# EAGLE schematic explorator_mainboard_v2_58mm (EAGLE 9.6.2)
CNAME: Parrot Teensy Board; CREVISION: 1.0; DESIGNER: Nathan Villicana-Shaw

## Sheet 1 of 2
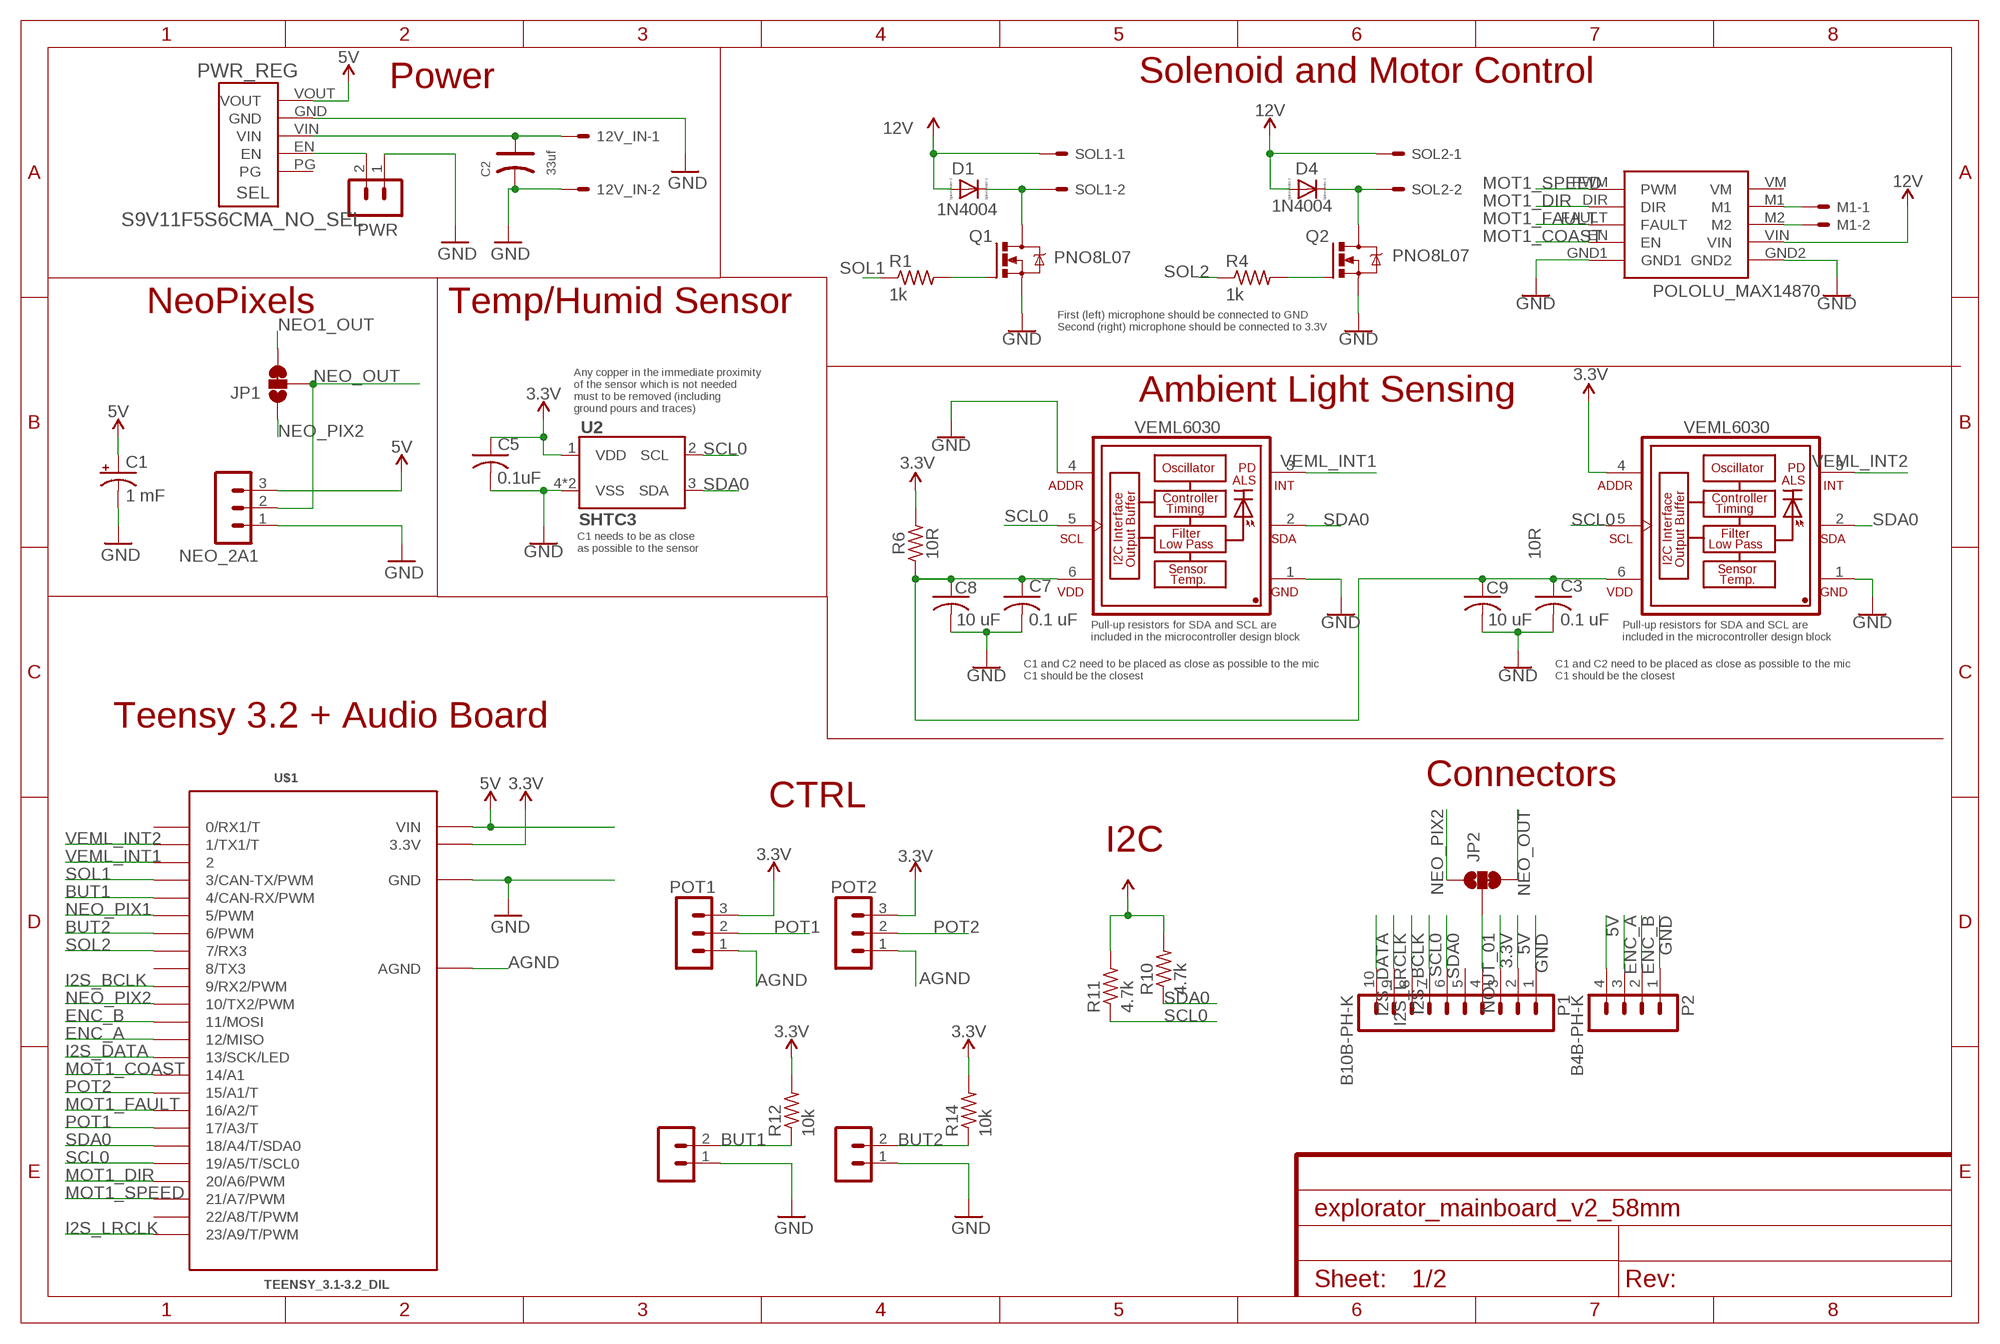
[diagram p0: schematic, sheet 1]

### Parts
12V_IN  5566-2  [5566-2]
BUT1  B2B-PH-K  [B2B-PH-K]
BUT2  B2B-PH-K  [B2B-PH-K]
C1  1 mF  CPOL-USUD-10X10  [UD-10X10_NICHICON]
C2  33uf  DIP-ALUMINUM-47UF-16V(D5-H7MM)  [PC-D5.3MM]
C3  0.1 uF  C-USC0805  [C0805]
C5  0.1uF  C-USC0805  [C0805]
C7  0.1 uF  C-USC0805  [C0805]
C8  10 uF  C-USC0805  [C0805]
C9  10 uF  C-USC0805  [C0805]
D1  1N4004  DIODE_E-DO35-7  [DIODE_DO35-7]
D4  1N4004  DIODE_E-DO35-7  [DIODE_DO35-7]
JP1  JUMPER-SMT_3_1-NC_TRACE_SILK  [SMT-JUMPER_3_1-NC_TRACE_SILK]
JP2  JUMPER-SMT_3_1-NC_TRACE_SILK  [SMT-JUMPER_3_1-NC_TRACE_SILK]
M1  5566-2  [5566-2]
MOT1  POLOLU_MAX14870  [POLOLU_MAX14870]
NEO_2A1  B3B-PH-K  [B3B-PH-K]
P1  B10B-PH-K  [B10B-PH-K]
P2  B4B-PH-K  [B4B-PH-K]
POT1  B3B-PH-K  [B3B-PH-K]
POT2  B3B-PH-K  [B3B-PH-K]
PWR  B2B-PH-K  [B2B-PH-K]
PWR_REG  S9V11F5S6CMA_NO_SEL  [S9V11F3S5CMA_NO_SEL]
Q1  PNO8L07  IRF540  [TO220BV]
Q2  PNO8L07  IRF540  [TO220BV]
R1  1k  R-US_R0805  [R0805]
R4  1k  R-US_R0805  [R0805]
R6  10 R  R-US_R0805  [R0805]
R10  4.7k  R-US_R0805  [R0805]
R11  4.7k  R-US_R0805  [R0805]
R12  10k  R-US_R0805  [R0805]
R14  10k  R-US_R0805  [R0805]
SOL1  5566-2  [5566-2]
SOL2  5566-2  [5566-2]
U2  SHTC3  [SHTC3]
U$1  TEENSY_3.1-3.2_DIL  [TEENSY_3.0-3.2&LC_DIL]
VMEL1  VEML6030  VEML6030-GS15  [VISHAY_VEML6030_2X2X0.87]
VMEL2  VEML6030  VEML6030-GS15  [VISHAY_VEML6030_2X2X0.87]

### Nets
3.3V [3.3V]: C5.1 P1.3 POT1.3 POT2.3 R6.2 R10.2 R11.2 R12.2 R14.2 U2.1(VDD) U$1.3.3V VMEL2.4(ADDR)
5V: C1.+ NEO_2A1.3 P1.2 P2.4 PWR_REG.VOUT U$1.VIN ; also sheet 2
12V [12V_IN]: 12V_IN.1 C2.+ D1.A(C) D4.A(C) MOT1.VIN PWR_REG.VIN SOL1.1 SOL2.1
AGND: POT1.1 POT2.1 U$1.AGND
BUT1: BUT1.2 R12.1 U$1.4(4/CAN-RX/PWM)
BUT2: BUT2.2 R14.1 U$1.6(6/PWM)
ENC_A: P2.3 U$1.12(12/MISO)
ENC_B: P2.2 U$1.11(11/MOSI)
GND: 12V_IN.2 BUT1.1 BUT2.1 C1.- C2.- C3.2 C5.2 C7.2 C8.2 C9.2 MOT1.GND1 MOT1.GND2 NEO_2A1.1 P1.1 P2.1 PWR.1 PWR_REG.GND Q1.S Q2.S U2.4(VSS) U2.5(VSS) U$1.GND VMEL1.1(GND) VMEL1.4(ADDR) VMEL2.1(GND) ; also sheet 2
I2S_BCLK: P1.8 U$1.9(9/RX2/PWM)
I2S_DATA: P1.10 U$1.13(13/SCK/LED)
I2S_LRCLK: P1.9 U$1.23/A9(23/A9/T/PWM)
MOT1_COAST: MOT1.EN U$1.14/A0(14/A1)
MOT1_DIR: MOT1.DIR U$1.20/A6(20/A6/PWM)
MOT1_FAULT: MOT1.FAULT U$1.16/A2(16/A2/T)
MOT1_SPEED: MOT1.PWM U$1.21/A7(21/A7/PWM)
N$1: M1.2 MOT1.M2
N$2: M1.1 MOT1.M1
N$7: C3.1 C7.1 C8.1 C9.1 R6.1 VMEL1.6(VDD) VMEL2.6(VDD)
N$10: PWR.2 PWR_REG.EN
N$13: Q2.G R4.2
N$14: D4.C(A) Q2.D SOL2.2
N$24: Q1.G R1.2
N$25: D1.C(A) Q1.D SOL1.2
NEO1_OUT: JP1.3 ; also sheet 2
NEO_OUT: JP1.2 JP2.3 NEO_2A1.2
NEO_PIX1: U$1.5(5/PWM) ; also sheet 2
NEO_PIX2: JP1.1 JP2.1 U$1.10(10/TX2/PWM)
NOUT_01: JP2.2 P1.4
POT1: POT1.2 U$1.17/A3(17/A3/T)
POT2: POT2.2 U$1.15/A1(15/A1/T)
SCL0: P1.7 R11.1 U2.2(SCL) U$1.19/A5(19/A5/T/SCL0) VMEL1.5(SCL) VMEL2.5(SCL)
SDA0: P1.6 R10.1 U2.3(SDA) U$1.18/A4(18/A4/T/SDA0) VMEL1.2(SDA) VMEL2.2(SDA)
SOL1: R1.1 U$1.3(3/CAN-TX/PWM)
SOL2: R4.1 U$1.7(7/RX3)
VEML_INT1: U$1.2 VMEL1.3(INT)
VEML_INT2: U$1.1(1/TX1/T) VMEL2.3(INT)
Unconnected: MOT1.VM P1.5 PWR_REG.PG U$1.0(0/RX1/T) U$1.8(8/TX3) U$1.22/A8(22/A8/T/PWM)

### Notes on the sheet
- Power | Solenoid and Motor Control
- NeoPixels | Temp/Humid Sensor
- First (left) microphone should be connected to GND
  Second (right) microphone should be connected to 3.3V
- Ambient Light Sensing
- Any copper in the immediate proximity 
  of the sensor which is not needed
  must to be removed (including 
  ground pours and traces)
- C1 needs to be as close
  as possible to the sensor
- 10R | 10R
- Pull-up resistors for SDA and SCL are 
  included in the microcontroller design block
- Pull-up resistors for SDA and SCL are 
  included in the microcontroller design block
- C1 and C2 need to be placed as close as possible to the mic
  C1 should be the closest
- C1 and C2 need to be placed as close as possible to the mic
  C1 should be the closest
- Teensy 3.2 + Audio Board
- Connectors
- CTRL
- I2C

## Sheet 2 of 2
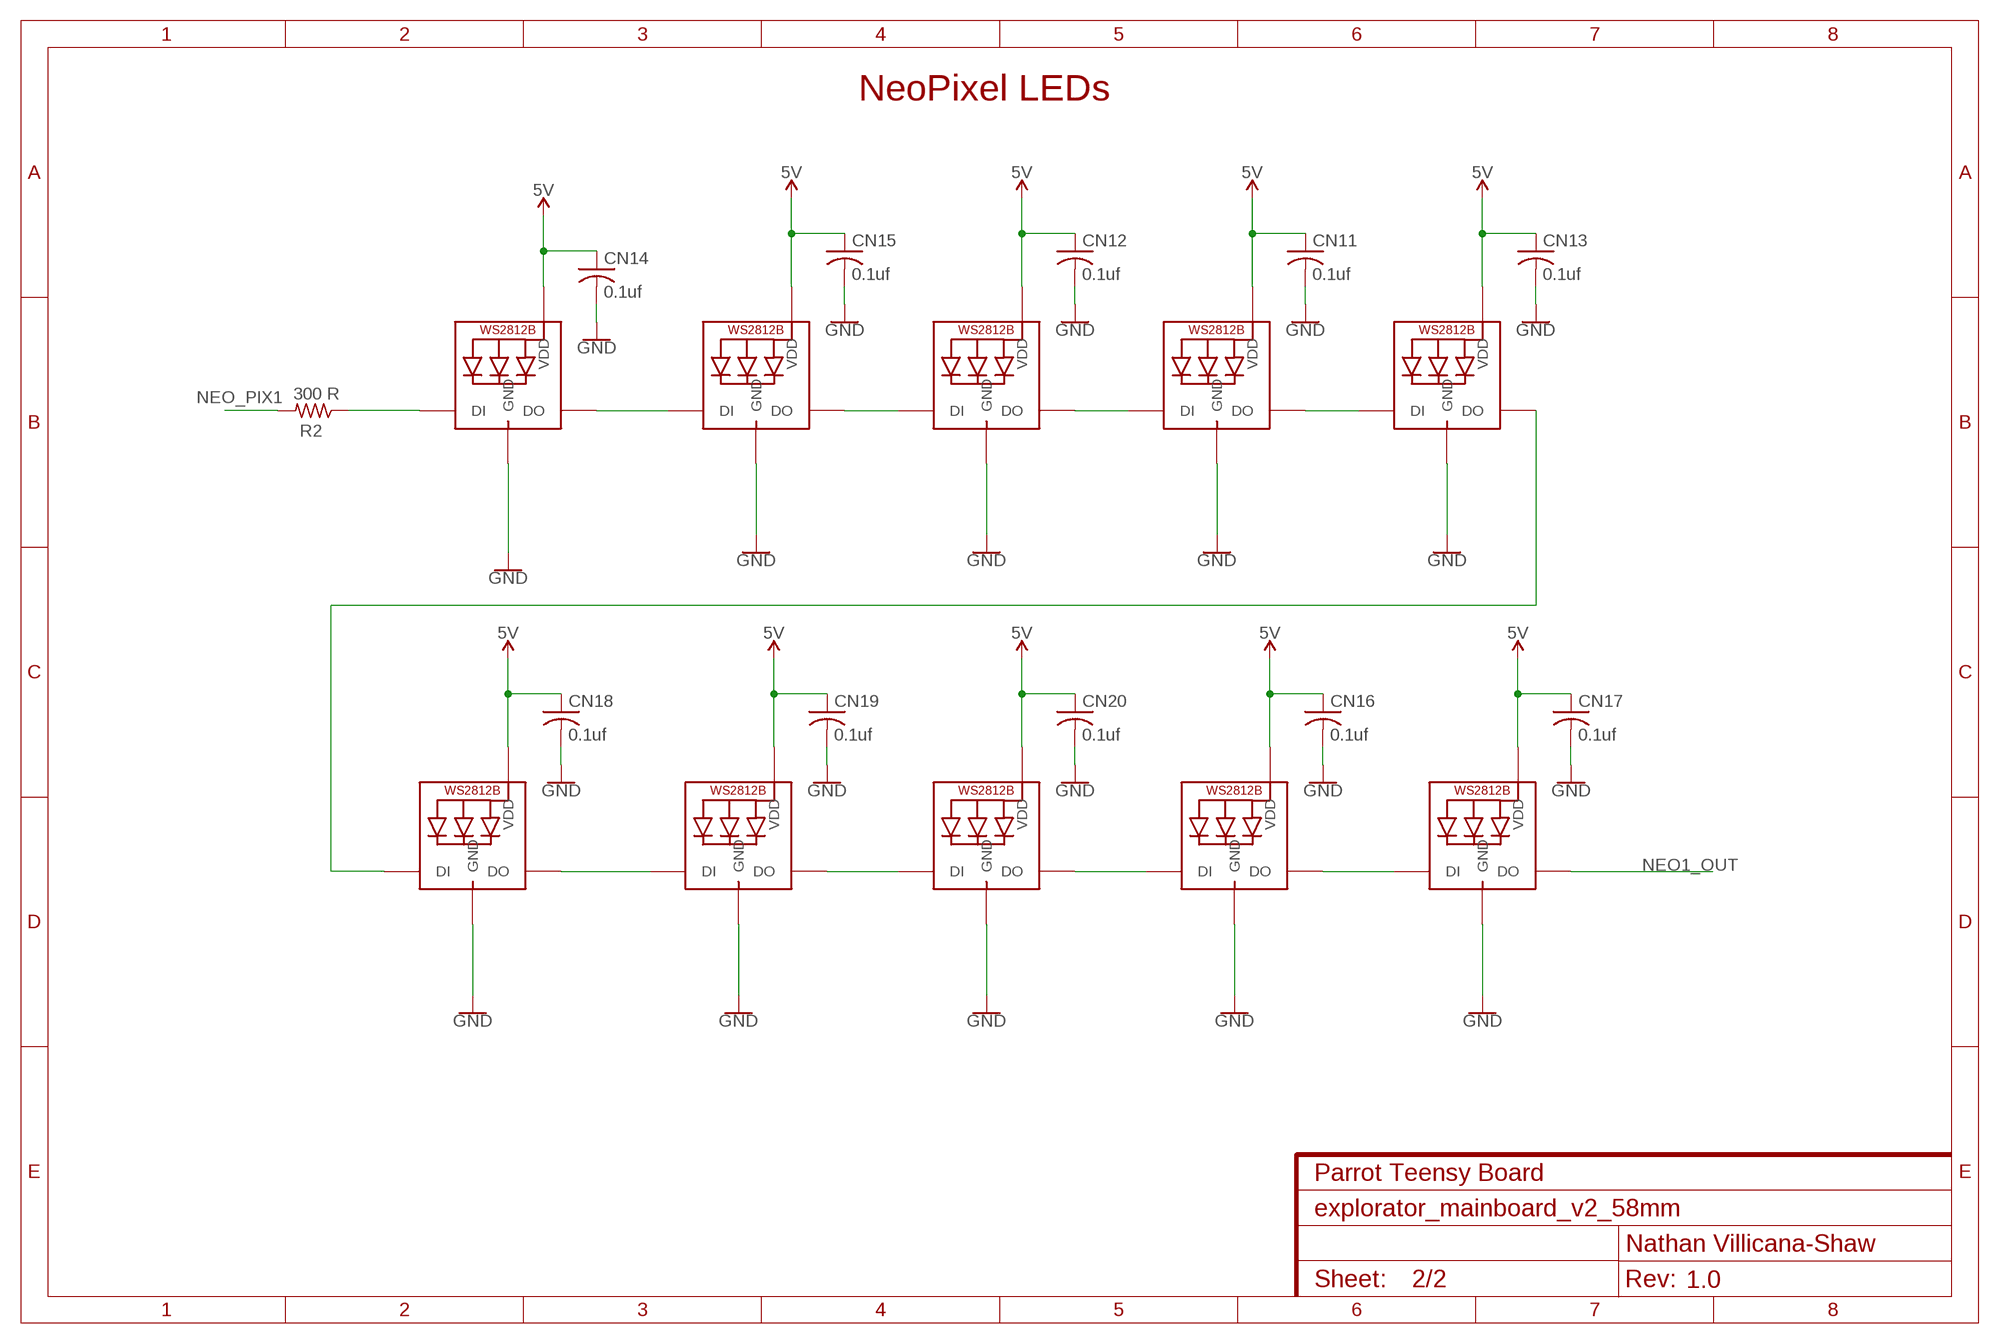
[diagram p1: schematic, sheet 2]

### Parts
CN11  0.1uf  C-USC0805K  [C0805K]
CN12  0.1uf  C-USC0805K  [C0805K]
CN13  0.1uf  C-USC0805K  [C0805K]
CN14  0.1uf  C-USC0805K  [C0805K]
CN15  0.1uf  C-USC0805K  [C0805K]
CN16  0.1uf  C-USC0805K  [C0805K]
CN17  0.1uf  C-USC0805K  [C0805K]
CN18  0.1uf  C-USC0805K  [C0805K]
CN19  0.1uf  C-USC0805K  [C0805K]
CN20  0.1uf  C-USC0805K  [C0805K]
NEO11  WS2812B5050  [WS2812B]
NEO12  WS2812B5050  [WS2812B]
NEO13  WS2812B5050  [WS2812B]
NEO14  WS2812B5050  [WS2812B]
NEO15  WS2812B5050  [WS2812B]
NEO16  WS2812B5050  [WS2812B]
NEO17  WS2812B5050  [WS2812B]
NEO18  WS2812B5050  [WS2812B]
NEO19  WS2812B5050  [WS2812B]
NEO20  WS2812B5050  [WS2812B]
R2  300 R  R-US_R0805  [R0805]

### Nets
5V: CN11.1 CN12.1 CN13.1 CN14.1 CN15.1 CN16.1 CN17.1 CN18.1 CN19.1 CN20.1 NEO11.1-VDD(VDD) NEO12.1-VDD(VDD) NEO13.1-VDD(VDD) NEO14.1-VDD(VDD) NEO15.1-VDD(VDD) NEO16.1-VDD(VDD) NEO17.1-VDD(VDD) NEO18.1-VDD(VDD) NEO19.1-VDD(VDD) NEO20.1-VDD(VDD) ; also sheet 1
GND: CN11.2 CN12.2 CN13.2 CN14.2 CN15.2 CN16.2 CN17.2 CN18.2 CN19.2 CN20.2 NEO11.3-GND(GND) NEO12.3-GND(GND) NEO13.3-GND(GND) NEO14.3-GND(GND) NEO15.3-GND(GND) NEO16.3-GND(GND) NEO17.3-GND(GND) NEO18.3-GND(GND) NEO19.3-GND(GND) NEO20.3-GND(GND) ; also sheet 1
N$17: NEO14.2-DOUT(DO) NEO15.4-DIN(DI)
N$18: NEO12.4-DIN(DI) NEO15.2-DOUT(DO)
N$19: NEO11.4-DIN(DI) NEO12.2-DOUT(DO)
N$20: NEO11.2-DOUT(DO) NEO13.4-DIN(DI)
N$21: NEO13.2-DOUT(DO) NEO18.4-DIN(DI)
N$22: NEO14.4-DIN(DI) R2.1
N$23: NEO18.2-DOUT(DO) NEO19.4-DIN(DI)
N$26: NEO19.2-DOUT(DO) NEO20.4-DIN(DI)
N$27: NEO16.4-DIN(DI) NEO20.2-DOUT(DO)
N$28: NEO16.2-DOUT(DO) NEO17.4-DIN(DI)
NEO1_OUT: NEO17.2-DOUT(DO) ; also sheet 1
NEO_PIX1: R2.2 ; also sheet 1

### Notes on the sheet
- NeoPixel LEDs

## Library data of the parts
12V_IN M1 SOL1 SOL2 = con-molex:5566-2: Mini FIT connector 2 pol Source: http://www.molex.com; MF: MOLEX; OC_FARNELL: 1822072; OC_NEWARK: unknown
BUT1 BUT2 PWR = con-jst-ph:B2B-PH-K: HEADER
C1 = rcl:CPOL-US: POLARIZED CAPACITOR, American symbol; SPICEPREFIX: C
C2 = Seeed-Capacitor:DIP-ALUMINUM-47UF-16V(D5-H7MM): 302030033; MPN: KS 100uF/16V; VALUE: 100uf
C3 C5 C7-C9 = rcl:C-US: CAPACITOR, American symbol; SPICEPREFIX: C
CN11-CN20 = resistor:C-US: CAPACITOR, American symbol
D1 D4 = eagle-ltspice:DIODE_E-: Schottky Diode; SPICEMODEL: diode; SPICEPREFIX: D
JP1 JP2 = SparkFun-Jumpers:JUMPER-SMT_3_1-NC_TRACE: Normally closed trace jumper (1 of 2 connections) This jumper has a trace between two pads so it's normally closed (NC). The other connection is normally open (NO). Use a razor knife to open the connection. For best results follow the IPC guidelines for cutting traces: Cutout at least 0.063 mm (0.005 in). Remove all loose material to clean up the cut area. Seal the cut with an approved epoxy. Reapply solder to reclose the connection, or to close the NO connection.
MOT1 = nathans-custom-parts:POLOLU_MAX14870
NEO11-NEO20 = nathans-custom-parts:WS2812B
NEO_2A1 POT1 POT2 = con-jst-ph:B3B-PH-K: HEADER
P1 = con-jst-ph:B10B-PH-K: HEADER
P2 = con-jst-ph:B4B-PH-K: HEADER
PWR_REG = nathans-custom-parts:S9V11F5S6CMA_NO_SEL
Q1 Q2 = nathans-custom-parts:IRF540: HEXFET Power MOSFET
R1 R4 R10-R12 R14 = rcl:R-US_: RESISTOR, American symbol; SPICEPREFIX: R
R2 R6 = audio amplifier example:R-US_: RESISTOR, American symbol
U2 = SHTC3:SHTC3
U$1 = Teensy_3_and_LC_Series_Boards_v1.4:TEENSY_3.1-3.2_DIL: Teensy 3.1 or 3.2 in a DIL Layout.
VMEL1 VMEL2 = VEML6030-GS15:VEML6030-GS15: VEML6030 High Accuracy Ambient Light Sensor with I2C Interface: VEML6030 is a high accuracy ambient light digital 16-bit resolution sensor in a miniature transparent 2 mm x 2 mm package. It includes a high sensitive photodiode, a low noise amplifier, a 16-bit A/D converter and supports an easy to use I2C bus communication interface and additional interrupt feature. The ambient light result is as digital value available. Device Model created 15.06.2016 by Johannes Kolb - Vishay Semiconductor GmbH; AVAILABILITY: Unavailable; DESCRIPTION: Optical Sensor Ambient 550nm I²C 6-SMD, No Lead; MF: Vishay Semiconductor; MP: VEML6030-GS15; PACKAGE: SMD-6 Vishay; PRICE: None

## Net classes
0 default: width 0.203 mm, drill 0.254 mm, clearance 0.178 mm
1 12V_IN: width 1.016 mm, drill 0.381 mm, clearance 0.203 mm
2 3.3V: width 0.305 mm, drill 0.305 mm, clearance 0.203 mm
3 5V: width 0.635 mm, drill 0.305 mm, clearance 0.203 mm